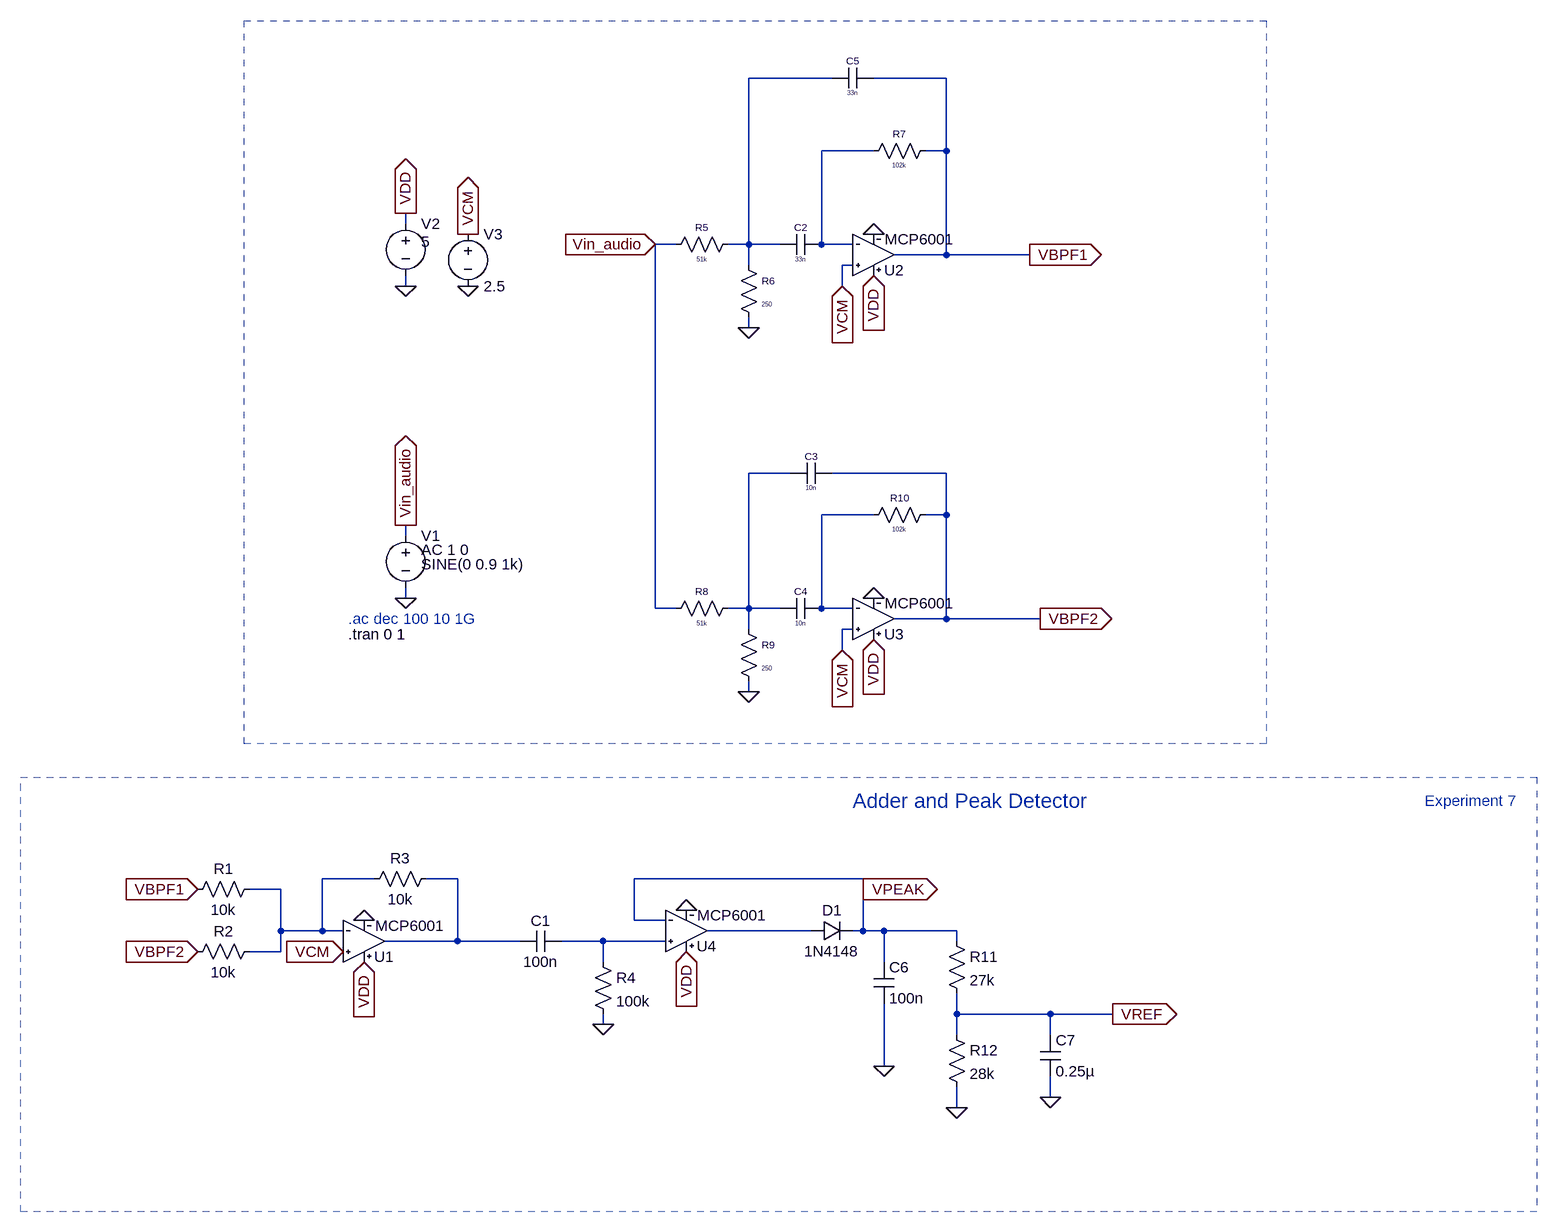
[diagram p0: schematic Experiment 7 - Adder and Peak Detector.asc]
Experiment 7 - Adder and Peak Detector.asc, the LTspice schematic file:
Version 4
SHEET 1 2080 724
WIRE 992 -1024 864 -1024
WIRE 1168 -1024 1056 -1024
WIRE 1056 -912 976 -912
WIRE 1168 -912 1168 -1024
WIRE 1168 -912 1136 -912
WIRE 336 -800 336 -816
WIRE 752 -768 720 -768
WIRE 864 -768 864 -1024
WIRE 864 -768 832 -768
WIRE 912 -768 864 -768
WIRE 976 -768 976 -912
WIRE 1024 -768 976 -768
WIRE 1168 -752 1168 -912
WIRE 1168 -752 1088 -752
WIRE 1296 -752 1168 -752
WIRE 864 -736 864 -768
WIRE 1024 -736 1008 -736
WIRE 336 -704 336 -720
WIRE 1008 -704 1008 -736
WIRE 864 -640 864 -656
WIRE 928 -416 864 -416
WIRE 1168 -416 992 -416
WIRE 1056 -352 976 -352
WIRE 1168 -352 1168 -416
WIRE 1168 -352 1136 -352
WIRE 336 -320 336 -336
WIRE 336 -224 336 -240
WIRE 720 -208 720 -768
WIRE 752 -208 720 -208
WIRE 864 -208 864 -416
WIRE 864 -208 832 -208
WIRE 912 -208 864 -208
WIRE 976 -208 976 -352
WIRE 1024 -208 976 -208
WIRE 1168 -192 1168 -352
WIRE 1168 -192 1088 -192
WIRE 1312 -192 1168 -192
WIRE 864 -176 864 -208
WIRE 1024 -176 1008 -176
WIRE 1008 -144 1008 -176
WIRE 864 -80 864 -96
WIRE 288 208 208 208
WIRE 416 208 368 208
WIRE 1040 208 688 208
WIRE 144 224 96 224
WIRE 1040 224 1040 208
WIRE 688 272 688 208
WIRE 736 272 688 272
WIRE 144 288 144 224
WIRE 208 288 208 208
WIRE 208 288 144 288
WIRE 240 288 208 288
WIRE 960 288 800 288
WIRE 1040 288 1040 224
WIRE 1040 288 1024 288
WIRE 1072 288 1040 288
WIRE 1184 288 1072 288
WIRE 416 304 416 208
WIRE 416 304 304 304
WIRE 512 304 416 304
WIRE 640 304 576 304
WIRE 736 304 640 304
WIRE 1184 304 1184 288
WIRE 144 320 144 288
WIRE 144 320 96 320
WIRE 640 336 640 304
WIRE 1072 336 1072 288
WIRE 1184 416 1184 384
WIRE 1328 416 1184 416
WIRE 1424 416 1328 416
WIRE 640 432 640 416
WIRE 1184 448 1184 416
WIRE 1328 448 1328 416
WIRE 1072 496 1072 400
WIRE 1328 544 1328 512
WIRE 1184 560 1184 528
FLAG 16 224 VBPF1
IOPIN 16 224 In
FLAG 16 320 VBPF2
IOPIN 16 320 In
FLAG 640 432 0
FLAG 272 272 0
FLAG 272 336 VDD
IOPIN 272 336 In
FLAG 336 -336 Vin_audio
IOPIN 336 -336 Out
FLAG 336 -224 0
FLAG 336 -704 0
FLAG 336 -816 VDD
IOPIN 336 -816 Out
FLAG 864 -640 0
FLAG 720 -768 Vin_audio
IOPIN 720 -768 In
FLAG 864 -80 0
FLAG 1008 -704 VCM
IOPIN 1008 -704 In
FLAG 1008 -144 VCM
IOPIN 1008 -144 In
FLAG 1312 -192 VBPF2
IOPIN 1312 -192 Out
FLAG 1296 -752 VBPF1
IOPIN 1296 -752 Out
FLAG 1056 -224 0
FLAG 1056 -784 0
FLAG 1056 -160 VDD
IOPIN 1056 -160 In
FLAG 1056 -720 VDD
IOPIN 1056 -720 In
FLAG 432 -704 0
FLAG 432 -784 VCM
IOPIN 432 -784 Out
FLAG 240 320 VCM
IOPIN 240 320 In
FLAG 768 256 0
FLAG 768 320 VDD
IOPIN 768 320 In
FLAG 1184 560 0
FLAG 1328 544 0
FLAG 1424 416 VREF
IOPIN 1424 416 Out
FLAG 1072 496 0
FLAG 1040 224 VPEAK
IOPIN 1040 224 Out
SYMBOL res 112 208 R90
WINDOW 0 0 56 VBottom 2
WINDOW 3 32 56 VTop 2
SYMATTR InstName R1
SYMATTR Value 10k
SYMBOL res 112 304 R90
WINDOW 0 0 56 VBottom 2
WINDOW 3 32 56 VTop 2
SYMATTR InstName R2
SYMATTR Value 10k
SYMBOL MCP6001 272 304 M180
SYMATTR InstName U1
SYMBOL res 384 192 R90
WINDOW 0 0 56 VBottom 2
WINDOW 3 32 56 VTop 2
SYMATTR InstName R3
SYMATTR Value 10k
SYMBOL cap 576 288 R90
WINDOW 0 0 32 VBottom 2
WINDOW 3 32 32 VTop 2
SYMATTR InstName C1
SYMATTR Value 100n
SYMBOL res 624 320 R0
SYMATTR InstName R4
SYMATTR Value 100k
SYMBOL diode 960 304 R270
WINDOW 0 32 32 VTop 2
WINDOW 3 0 32 VBottom 2
SYMATTR InstName D1
SYMATTR Value 1N4148
SYMBOL MCP6001 1056 -752 M180
SYMATTR InstName U2
SYMBOL MCP6001 1056 -192 M180
SYMATTR InstName U3
SYMBOL voltage 336 -336 R0
WINDOW 3 24 60 Left 2
WINDOW 123 24 38 Left 2
SYMATTR Value SINE(0 0.9 1k)
SYMATTR Value2 AC 1 0
SYMATTR InstName V1
SYMBOL voltage 336 -816 R0
WINDOW 3 24 44 Left 2
SYMATTR Value 5
SYMATTR InstName V2
SYMBOL res 848 -784 R90
WINDOW 0 0 56 VBottom 1
WINDOW 3 32 56 VTop 0
SYMATTR InstName R5
SYMATTR Value 51k
SYMBOL res 848 -752 R0
WINDOW 0 36 40 Left 1
WINDOW 3 36 76 Left 0
SYMATTR InstName R6
SYMATTR Value 250
SYMBOL res 1040 -896 R270
WINDOW 0 32 56 VTop 1
WINDOW 3 0 56 VBottom 0
SYMATTR InstName R7
SYMATTR Value 102k
SYMBOL cap 976 -784 R90
WINDOW 0 0 32 VBottom 1
WINDOW 3 32 32 VTop 0
SYMATTR InstName C2
SYMATTR Value 33n
SYMBOL res 848 -224 R90
WINDOW 0 0 56 VBottom 1
WINDOW 3 32 56 VTop 0
SYMATTR InstName R8
SYMATTR Value 51k
SYMBOL res 848 -192 R0
WINDOW 0 36 40 Left 1
WINDOW 3 36 76 Left 0
SYMATTR InstName R9
SYMATTR Value 250
SYMBOL res 1040 -336 R270
WINDOW 0 32 56 VTop 1
WINDOW 3 0 56 VBottom 0
SYMATTR InstName R10
SYMATTR Value 102k
SYMBOL cap 992 -432 R90
WINDOW 0 0 32 VBottom 1
WINDOW 3 32 32 VTop 0
SYMATTR InstName C3
SYMATTR Value 10n
SYMBOL cap 976 -224 R90
WINDOW 0 0 32 VBottom 1
WINDOW 3 32 32 VTop 0
SYMATTR InstName C4
SYMATTR Value 10n
SYMBOL cap 1056 -1040 R90
WINDOW 0 0 32 VBottom 1
WINDOW 3 32 32 VTop 0
SYMATTR InstName C5
SYMATTR Value 33n
SYMBOL Voltage 432 -800 R0
SYMATTR InstName V3
SYMATTR Value 2.5
SYMBOL MCP6001 768 288 M180
SYMATTR InstName U4
SYMBOL Cap 1056 336 R0
SYMATTR InstName C6
SYMATTR Value 100n
SYMBOL res 1168 288 R0
SYMATTR InstName R11
SYMATTR Value 27k
SYMBOL res 1168 432 R0
SYMATTR InstName R12
SYMATTR Value 28k
SYMBOL cap 1312 448 R0
SYMATTR InstName C7
SYMATTR Value 0.25µ
TEXT 248 -192 Left 2 ;.ac dec 100 10 1G
TEXT 248 -168 Left 2 !.tran 0 1
TEXT 1024 88 Left 3 ;Adder and Peak Detector
TEXT 1904 88 Left 2 ;Experiment 7
RECTANGLE Normal 88 -1112 1660 0 2
RECTANGLE Normal -256 52 2076 720 2

The netlist it stands for:
* Experiment 7 - Adder and Peak Detector.asc
R1 N005 VBPF1 10k
R2 N005 VBPF2 10k
XU1 VCM N005 VDD 0 N006 MCP6001
R3 N006 N005 10k
C1 N008 N006 100n
R4 N008 0 100k
D1 N007 VPEAK 1N4148
XU2 VCM N002 VDD 0 VBPF1 MCP6001
XU3 VCM N004 VDD 0 VBPF2 MCP6001
V1 Vin_audio 0 SINE(0 0.9 1k) AC 1 0
V2 VDD 0 5
R5 N001 Vin_audio 51k
R6 N001 0 250
R7 N002 VBPF1 102k
C2 N002 N001 33n
R8 N003 Vin_audio 51k
R9 N003 0 250
R10 N004 VBPF2 102k
C3 VBPF2 N003 10n
C4 N004 N003 10n
C5 VBPF1 N001 33n
V3 VCM 0 2.5
XU4 N008 VPEAK VDD 0 N007 MCP6001
C6 VPEAK 0 100n
R11 VPEAK VREF 27k
R12 VREF 0 28k
C7 VREF 0 0.25µ
.model D D
.lib standard.dio
* .ac dec 100 10 1G
.tran 0 1
* Adder and Peak Detector
* Experiment 7
.lib ./MCP6001.lib
.backanno
.end